# Altium schematic sheet AC Connectors.SchDoc: AC Output Connectors
size A4; DocumentNumber: 7; SheetNumber: 7; SheetTotal: 9
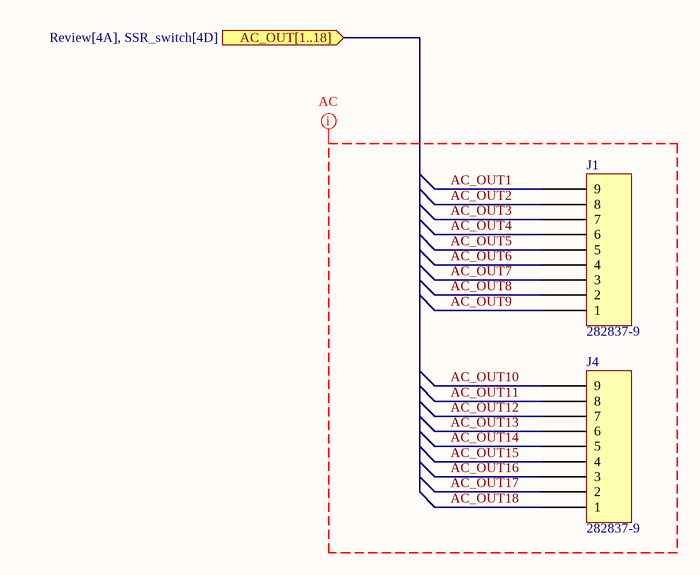
[diagram p0: AC Connectors.SchDoc]

## Parts
J1  282837-9  [TE 282837-9]
J4  282837-9  [TE 282837-9]

## Ports
AC_OUT[1..18] (in, see Review[4A], SSR_switch[4D])

## Nets
AC_OUT1: J1.9
AC_OUT2: J1.8
AC_OUT3: J1.7
AC_OUT4: J1.6
AC_OUT5: J1.5
AC_OUT6: J1.4
AC_OUT7: J1.3
AC_OUT8: J1.2
AC_OUT9: J1.1
AC_OUT10: J4.9
AC_OUT11: J4.8
AC_OUT12: J4.7
AC_OUT13: J4.6
AC_OUT14: J4.5
AC_OUT15: J4.4
AC_OUT16: J4.3
AC_OUT17: J4.2
AC_OUT18: J4.1

## Layout directives
net class AC: AC_OUT1, AC_OUT2, AC_OUT3, AC_OUT4, AC_OUT5, AC_OUT6, AC_OUT7, AC_OUT8, AC_OUT9, AC_OUT10, AC_OUT11, AC_OUT12, AC_OUT13, AC_OUT14, AC_OUT15, AC_OUT16, AC_OUT17, AC_OUT18

## Notes on the sheet
- Title
- Size:
- Date:
- A4
- Number:
- Time:
- Revision:
- Sheet
- of
- File:

## Library data of the parts
J1 J4 = 282837-9: TERM BLK 9P SIDE ENT 5.08MM PCB; Manufacturer: TE Connectivity AMP Connectors; Current: 13.5 A; Mating Orientation: Horizontal with Board; Number of Levels: 1; Pitch: 0.200" (5.08mm); Positions Per Level: 9; Voltage: 300 V; Wire Gauge: 16-28 AWG; Wire Termination: Screw - Rising Cage Clamp; Part Number: 282837-9; Color: Green; ComponentLink1Description: Datasheet; ComponentLink1URL: https://www.te.com/commerce/DocumentDelivery/DDEController?Action=srchrtrv&DocNm=282837&DocType=Customer+Drawing&DocLang=English; ComponentLink2Description: DigiKey Link; ComponentLink2URL: https://www.digikey.com/en/products/detail/te-connectivity-amp-connectors/282837-9/1136739; Features: Interlocking (Side); LastUpdated: 6/21/2022 3:02:09 PM; Lifecycle Status: Active; Minimum Order: 1; Mounting Type: Through Hole; Packaging: Bulk; Part Status: Active; Price: 2.30; Series: Buchanan; Supplier 1: DigiKey; Supplier Part Number 1: A135915-ND